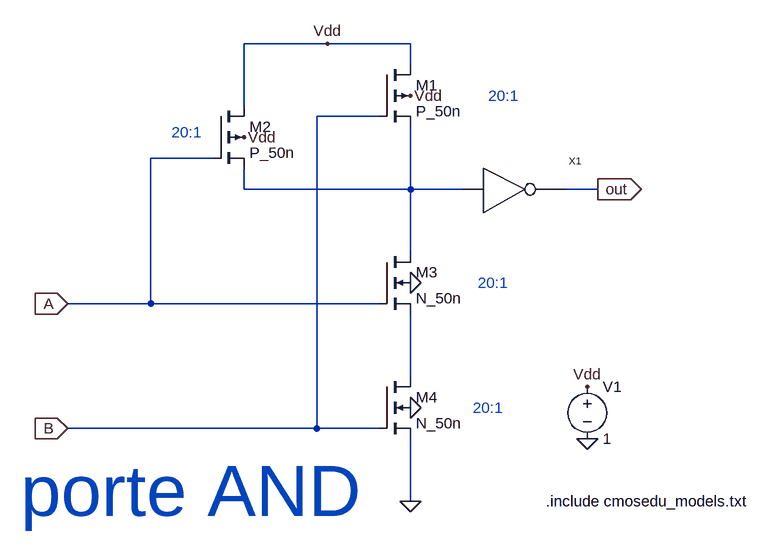
[diagram p0: schematic AND.asc]
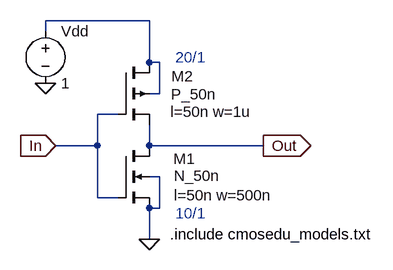
[diagram p1: sub-circuit inverter.asc]
AND.asc, the LTspice schematic file:
Version 4
SHEET 1 880 680
WIRE 0 -192 -128 -192
WIRE 128 -192 0 -192
WIRE 128 -160 128 -192
WIRE -128 -96 -128 -192
WIRE 80 -80 -16 -80
WIRE -176 -16 -272 -16
WIRE -128 32 -128 0
WIRE 128 32 128 -64
WIRE 128 32 -128 32
WIRE 208 32 128 32
WIRE 416 32 368 32
WIRE 128 128 128 32
WIRE -272 208 -272 -16
WIRE -272 208 -400 208
WIRE 80 208 -272 208
WIRE 128 320 128 224
WIRE -16 400 -16 -80
WIRE -16 400 -400 400
WIRE 80 400 -16 400
WIRE 128 512 128 416
FLAG 128 512 0
FLAG 128 368 0
FLAG 128 176 0
FLAG -128 -48 Vdd
FLAG 128 -112 Vdd
FLAG 0 -192 Vdd
FLAG -400 208 A
IOPIN -400 208 In
FLAG -400 400 B
IOPIN -400 400 In
FLAG 416 32 out
IOPIN 416 32 Out
FLAG 400 416 0
FLAG 400 336 Vdd
SYMBOL pmos4 80 -160 R0
SYMATTR InstName M1
SYMATTR Value P_50n
SYMATTR Value2 l=50n w=1000n
SYMBOL pmos4 -176 -96 R0
SYMATTR InstName M2
SYMATTR Value P_50n
SYMATTR Value2 l=50n w=1000n
SYMBOL nmos4 80 128 R0
SYMATTR InstName M3
SYMATTR Value N_50n
SYMATTR Value2 l=50n w=1000n
SYMBOL nmos4 80 320 R0
SYMATTR InstName M4
SYMATTR Value N_50n
SYMATTR Value2 l=50n w=1000n
SYMBOL voltage 400 320 R0
WINDOW 123 0 0 Left 0
WINDOW 39 0 0 Left 0
SYMATTR InstName V1
SYMATTR Value 1
SYMBOL Inverter 240 -32 R0
SYMATTR InstName X1
TEXT 336 512 Left 2 !.include cmosedu_models.txt
TEXT 232 176 Left 2 ;20:1
TEXT 224 368 Left 2 ;20:1
TEXT 248 -112 Left 2 ;20:1
TEXT -240 -56 Left 2 ;20:1
TEXT -472 496 Left 7 ;porte AND

inverter.asc, the sub-circuit schematic file:
Version 4
SHEET 1 1136 680
WIRE 448 -368 288 -368
WIRE 288 -352 288 -368
WIRE 448 -304 448 -368
WIRE 464 -304 448 -304
WIRE 464 -256 464 -304
WIRE 464 -256 448 -256
WIRE 400 -224 368 -224
WIRE 368 -176 368 -224
WIRE 368 -176 304 -176
WIRE 448 -176 448 -208
WIRE 624 -176 448 -176
WIRE 464 -128 448 -128
WIRE 368 -96 368 -176
WIRE 400 -96 368 -96
WIRE 464 -80 464 -128
WIRE 464 -80 448 -80
WIRE 448 -32 448 -80
FLAG 304 -176 In
IOPIN 304 -176 In
FLAG 624 -176 Out
IOPIN 624 -176 Out
FLAG 448 -32 0
FLAG 288 -272 0
SYMBOL nmos4 400 -176 R0
WINDOW 0 119 20 Right 2
WINDOW 3 157 46 Right 2
WINDOW 123 238 76 Right 2
SYMATTR InstName M1
SYMATTR Value N_50n
SYMATTR Value2 l=50n w=500n
SYMBOL pmos4 400 -304 R0
WINDOW 0 116 21 Right 2
WINDOW 3 151 49 Right 2
WINDOW 123 206 76 Right 2
SYMATTR InstName M2
SYMATTR Value P_50n
SYMATTR Value2 l=50n w=1u
SYMBOL voltage 288 -368 R0
SYMATTR InstName Vdd
SYMATTR Value 1
TEXT 488 -312 Left 2 ;20/1
TEXT 488 -72 Left 2 ;10/1
TEXT 480 -40 Left 2 !.include cmosedu_models.txt

The netlist it stands for:
* AND.asc
M1 Vdd B N001 Vdd P_50n l=50n w=1000n
M2 Vdd A N001 Vdd P_50n l=50n w=1000n
M3 N001 A N002 0 N_50n l=50n w=1000n
M4 N002 B 0 0 N_50n l=50n w=1000n
V1 Vdd 0 1
XX1 N001 out inverter

* block symbol definitions
.subckt inverter In Out
M1 Out In 0 0 N_50n l=50n w=500n
M2 N001 In Out N001 P_50n l=50n w=1u
Vdd N001 0 1
* 20/1
* 10/1
.include cmosedu_models.txt
.ends inverter

.model NMOS NMOS
.model PMOS PMOS
.lib standard.mos
.include cmosedu_models.txt
* 20:1
* 20:1
* 20:1
* 20:1
* porte AND
.backanno
.end